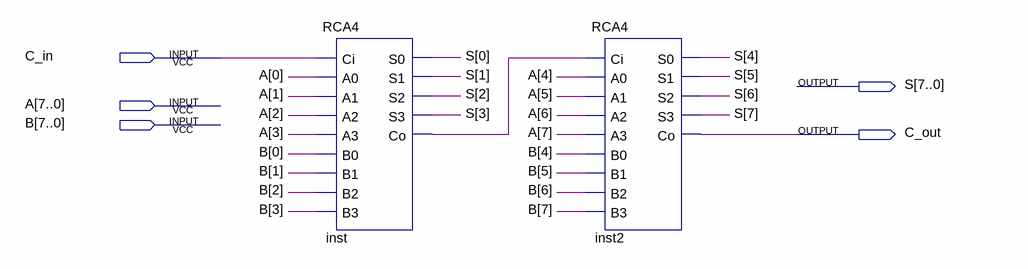
[diagram p0: schematic sheet]
// Quartus schematic RCA8.bdf as structural Verilog: 2 symbols, 5 pins
module RCA8 (
  input  C_in,
  input  [7:0] A,
  input  [7:0] B,
  output [7:0] S,
  output C_out
);

  wire inst_co;

  RCA4 inst (
    .Ci(C_in), .A0(A[0]), .A1(A[1]), .A2(A[2]), .A3(A[3]), .B0(B[0]), .B1(B[1]), .B2(B[2]), .B3(B[3]),
    .S0(S[0]), .S1(S[1]), .S2(S[2]), .S3(S[3]), .Co(inst_co));
  RCA4 inst2 (
    .Ci(inst_co), .A0(A[4]), .A1(A[5]), .A2(A[6]), .A3(A[7]), .B0(B[4]), .B1(B[5]), .B2(B[6]), .B3(B[7]),
    .S0(S[4]), .S1(S[5]), .S2(S[6]), .S3(S[7]), .Co(C_out));
endmodule
